# EAGLE schematic lamp_sch (EAGLE 6.6.0)
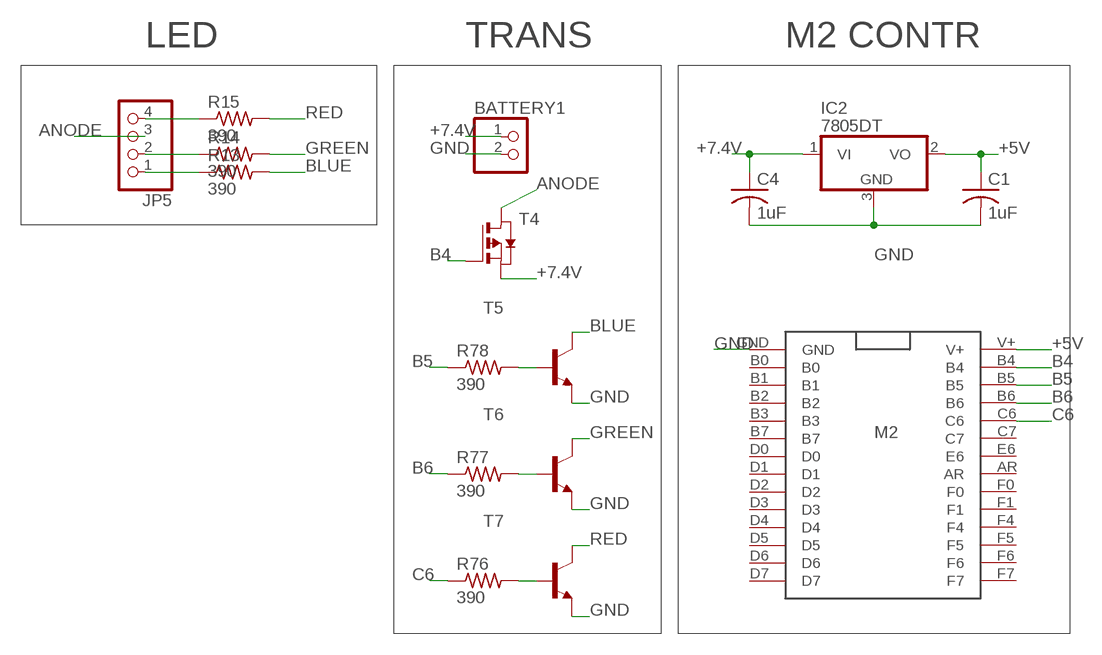
[diagram p0: schematic, sheet 1]

## Parts
BATTERY1  PINHD-1X2  [1X02]
C1  1uF  C-USC0603  [C0603]
C4  1uF  C-USC0603  [C0603]
IC2  7805DT  [TO252]
JP5  PINHD-1X4  [1X04]
R13  390  R-US_R0603  [R0603]
R14  390  R-US_R0603  [R0603]
R15  390  R-US_R0603  [R0603]
R76  390  R-US_R0603  [R0603]
R77  390  R-US_R0603  [R0603]
R78  390  R-US_R0603  [R0603]
T4  PMOSSOT23  [SOT-23]
T5  MMBT3904LT1-NPN-SOT23-BEC  [SOT23-BEC]
T6  MMBT3904LT1-NPN-SOT23-BEC  [SOT23-BEC]
T7  MMBT3904LT1-NPN-SOT23-BEC  [SOT23-BEC]
U$2  M2  [M2]

## Nets
+5V: C1.1 IC2.2(VO) U$2.V+
+7.4V: BATTERY1.1 C4.1 IC2.1(VI) T4.2(S)
ANODE: JP5.3 T4.1(D)
B4: T4.3(G) U$2.B4
B5: R78.1 U$2.B5
B6: R77.1 U$2.B6
BLUE: R13.2 T5.C
C6: R76.1 U$2.C6
GND: BATTERY1.2 C1.2 C4.2 IC2.3(GND) T5.E T6.E T7.E U$2.GND
GREEN: R14.2 T6.C
N$13: JP5.4 R15.1
N$14: JP5.2 R14.1
N$15: JP5.1 R13.1
N$76: R76.2 T7.B
N$77: R77.2 T6.B
N$78: R78.2 T5.B
RED: R15.2 T7.C
Unconnected: U$2.AR U$2.B0 U$2.B1 U$2.B2 U$2.B3 U$2.B7 U$2.C7 U$2.D0 U$2.D1 U$2.D2 U$2.D3 U$2.D4 U$2.D5 U$2.D6 U$2.D7 U$2.E6 U$2.F0 U$2.F1 U$2.F4 U$2.F5 U$2.F6 U$2.F7

## Notes on the sheet
- LED | TRANS | M2 CONTR

## Library data of the parts
BATTERY1 = pinhead:PINHD-1X2: PIN HEADER
C1 C4 = rcl:C-US: CAPACITOR, American symbol
IC2 = linear:78*: Positive VOLTAGE REGULATOR Source: http://cache.national.com/ds/LM/LM78L05.pdf http://www.fairchildsemi.com/ds/LM/LM7805.pdf
JP5 = pinhead:PINHD-1X4: PIN HEADER
R13-R15 R76-R78 = resistor:R-US_: RESISTOR, American symbol
T4 = zetex:PMOSSOT23: MOS FET; OC_FARNELL: unknown; OC_NEWARK: unknown
T5-T7 = transistor-neu-to92:*-NPN-: NPN Transistror
U$2 = M2:M2